# Altium schematic sheet pi.SchDoc
size A
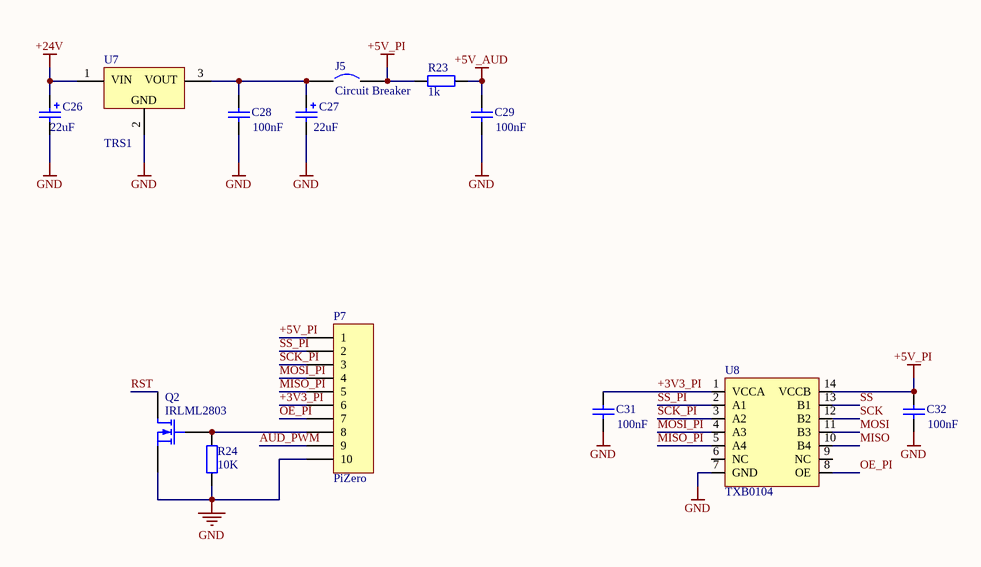
[diagram p0: pi.SchDoc]

## Parts
C26  value 22uF  [EEEFK1H]  (hidden comment: Cap Pol2)
C27  value 22uF  [EEEFK1H]  (hidden comment: Cap Pol2)
C28  value 100nF  [6-0805_M]  (hidden comment: Cap)
C29  value 100nF  [6-0805_M]  (hidden comment: Cap)
C31  value 100nF  [6-0805_M]  (hidden comment: Cap)
C32  value 100nF  [6-0805_M]  (hidden comment: Cap)
J5  Circuit Breaker  [SOLDER_JUMPER_24mil]
P7  PiZero  [HDR1X10]
Q2  IRLML2803  [SOT-23_N]
R23  value 1k  [6-0805_M]  (hidden comment: Res2)
R24  value 10K  [6-0805_M]  (hidden comment: Res2)
U7  TRS1  [TSR1-2450]
U8  TXB0104  [SOIC-14]

## Nets
+5V_AUD: C29.2 R23.2
+5V_PI: C32.2 J5.2 P7.1 R23.1 U8.14(VCCB)
+24V: C26.1 U7.1(+VIN)
GND: C26.2 C27.2 C28.1 C29.1 C31.1 C32.1 P7.10 Q2.3(S) R24.2 U7.2(GND) U8.7(GND)
+3V3_PI: C31.2 P7.6 U8.1(VCCA)
AUD_PWM: P7.9
MISO: U8.10(B4)
MISO_PI: P7.5 U8.5(A4)
MOSI: U8.11(B3)
MOSI_PI: P7.4 U8.4(A3)
OE_PI: P7.7 U8.8(OE)
RST: Q2.1(D)
~{SS}: U8.13(B1)
~{SS}_PI: P7.2 U8.2(A1)
SCK: U8.12(B2)
SCK_PI: P7.3 U8.3(A2)
NetC27_1: C27.1 C28.2 J5.1 U7.3(+VOUT)
NetP7_8: P7.8 Q2.2(G) R24.1

Not connected (* = marked no-connect by the designer): U8 6(NC) 9(NC)

## Notes on the sheet
- (in symbol TSR1-2450) VIN; VOUT

## Library data of the parts
C26 C27 = Cap Pol2: Polarized Capacitor (Axial); Published: 8-Jun-2000; LatestRevisionDate: 17-Jul-2002; LatestRevisionNote: Re-released for DXP Platform.; PackageReference: POLAR0.8; Publisher: Altium Limited; PackageDescription: Polarized Capacitor; 2 Leads
C28 C29 C31 C32 = Cap: Capacitor; Published: 8-Jun-2000; LatestRevisionDate: 17-Jul-2002; LatestRevisionNote: Re-released for DXP Platform.; PackageReference: RAD-0.3; Publisher: Altium Limited; PackageDescription: Radial Cap, Thru-Hole; 2 Leads; 0.3 in Pin Spacing
P7 = Header 10: Header, 10-Pin; LatestRevisionDate: 17-Jul-2002; LatestRevisionNote: Re-released for DXP Platform.; Publisher: Altium Limited
Q2 = MOSFET-N: N-Channel MOSFET; pin to pad: 1>3 2>1 3>2; Published: 8-Jun-2000; LatestRevisionDate: 17-Jul-2002; LatestRevisionNote: Re-released for DXP Platform.; PackageVersion: 1995/1996; PackageReference: E3; Publisher: Altium Limited; PackageDescription: TO, Flat Index; 3 In-Line, Axial Leads; Body Dia. 4.6mm; Lead Dia. 0.5 mm (max)
R23 R24 = Res2: Resistor; Published: 8-Jun-2000; LatestRevisionDate: 17-Jul-2002; LatestRevisionNote: Re-released for DXP Platform.; PackageReference: AXIAL-0.4; Publisher: Altium Limited; PackageDescription: Axial Device, Thru-Hole; 2 Leads; 0.4 in Pin Spacing
U7 = TSR1-2450: TSR1-2450 DC/DC Step-Down Converter
U8 = TXB0104: TXB0104 4bit Bidirectional Voltage-Level Translator
J5 = Circuit Breaker: Published: 24-Mar-1999; LatestRevisionDate: 17-Jul-2002; LatestRevisionNote: Re-released for DXP Platform.; PackageReference: SPST-2; Publisher: Altium Limited; PackageDescription: Switch; 2 Leads